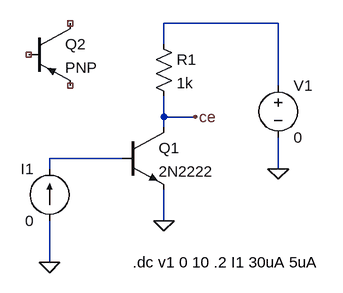
[diagram p0: schematic Transistor Characteristics.asc]
Transistor Characteristics.asc, the LTspice schematic file:
Version 4
SHEET 1 880 680
WIRE 320 32 144 32
WIRE 144 64 144 32
WIRE 320 128 320 32
WIRE 144 176 144 144
WIRE 192 176 144 176
WIRE 144 192 144 176
WIRE 80 240 -32 240
WIRE -32 256 -32 240
WIRE 320 256 320 208
WIRE 144 336 144 288
WIRE -32 400 -32 336
FLAG 320 256 0
FLAG 144 336 0
FLAG -32 400 0
FLAG 192 176 ce
SYMBOL npn 80 192 R0
SYMATTR InstName Q1
SYMATTR Value 2N2222
SYMBOL res 128 48 R0
SYMATTR InstName R1
SYMATTR Value 1k
SYMBOL current -32 336 R180
WINDOW 0 24 80 Left 2
WINDOW 3 24 0 Left 2
SYMATTR InstName I1
SYMATTR Value 0
SYMBOL voltage 320 112 R0
SYMATTR InstName V1
SYMATTR Value 0
SYMBOL pnp -64 32 R0
SYMATTR InstName Q2
TEXT 96 400 Left 2 !.dc v1 0 10 .2 I1 30uA 5uA

The netlist it stands for:
* Transistor Characteristics.asc
Q1 ce N002 0 0 2N2222
R1 N001 ce 1k
I1 0 N002 0
V1 N001 0 0
Q2 NC_01 NC_02 NC_03 0 PNP
.model NPN NPN
.model PNP PNP
.lib standard.bjt
.dc v1 0 10 .2 I1 30uA 5uA
.backanno
.end